# EasyEDA Pro project ProPrj_GD32W515PIQ6_board.epro

# Schematic Schematic1
Board Name: Board1; Create Date: 2026-06-21; Page Name: P1; Project Name: GD32W515PIQ6_board; Schematic Name: Schematic1; Update Date: 2026-06-27; Company: EasyEDA.com; Page Size: A4; Version: V1.0
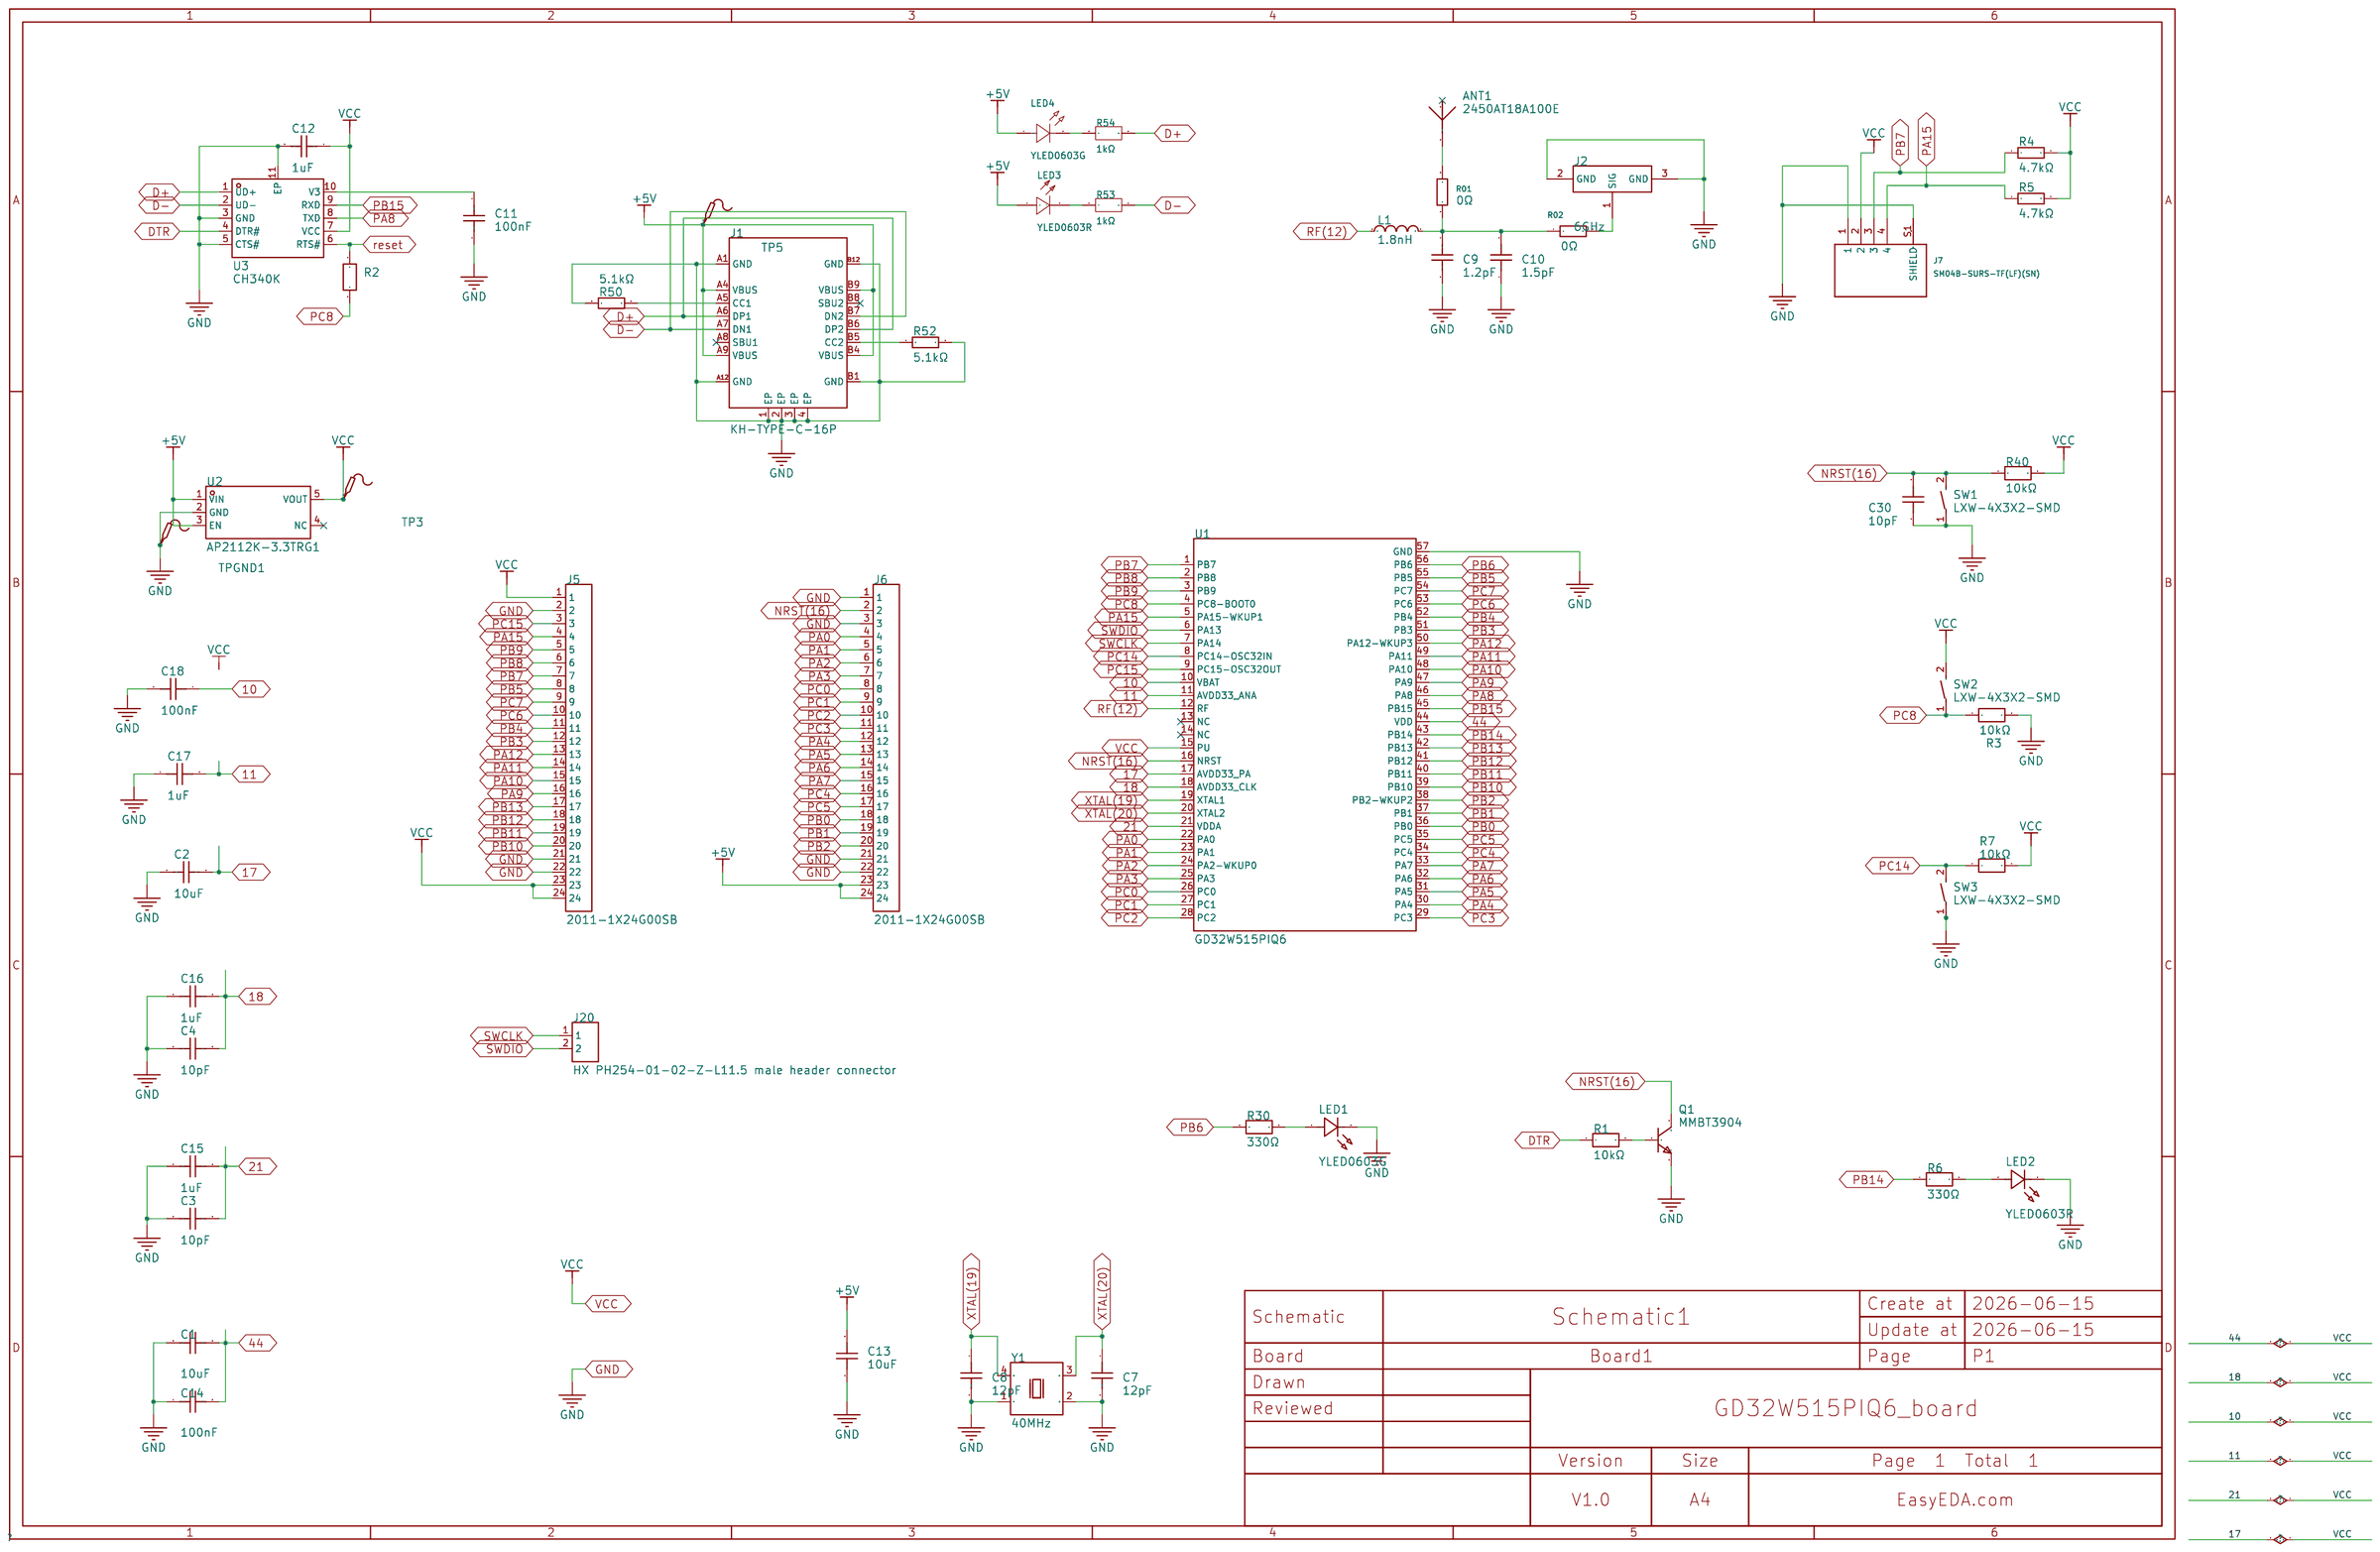
[diagram p0: schematic sheet]

## Parts
ANT1  2450AT18A100E  [ANT-SMD_L3.2-W1.6]
C1  10uF  [C0603]
C2  10uF  [C0603]
C3  10pF  [C0402]
C4  10pF  [C0402]
C7  12pF  [C0402]
C8  12pF  [C0402]
C9  1.2pF  [C0402]
C10  1.5pF  [C0402]
C11  100nF  [C0402]
C12  1uF  [C0603]
C13  10uF  [C0805]
C14  100nF  [C0402]
C15  1uF  [C0402]
C16  1uF  [C0402]
C17  1uF  [C0402]
C18  100nF  [C0402]
C30  10pF  [C0402]
J1  KH-TYPE-C-16P  [USB-C-SMD_KH-TYPE-C-16P]
J2  6GHz  [RF-SMD_FRF05002-JSS103M]
J5  2011-1X24G00SB  [HDR-TH_2011-1X24G00SB]
J6  2011-1X24G00SB  [HDR-TH_2011-1X24G00SB]
J7  SM04B-SURS-TF(LF)(SN)  [CONN-SMD_SM04B-SURS-TF-LF-SN]
J20  HX PH254-01-02-Z-L11.5 male header connector  [HDR-TH_2P-P2.54-V-M]
L1  1.8nH  [IND-SMD_L1.2-W0.6-1]
LED1  YLED0603G  [LED0603-FD]
LED2  YLED0603R  [LED0603-RD-1]
LED3  YLED0603R  [LED0603-FD]
LED4  YLED0603G  [LED0603-FD]
Q1  MMBT3904  [SOT-23-3_L2.9-W1.3-P1.90-LS2.4-BR]
R01  0Ω  [R0402]
R1  10kΩ  [R0402]
R02  0Ω  [R0402]
R2  1kΩ  [R0402]
R3  10kΩ  [R0402]
R4  4.7kΩ  [R0402]
R5  4.7kΩ  [R0402]
R6  330Ω  [R0402]
R7  10kΩ  [R0402]
R30  330Ω  [R0402]
R40  10kΩ  [R0402]
R50  5.1kΩ  [R0402]
R52  5.1kΩ  [R0402]
R53  1kΩ  [R0402]
R54  1kΩ  [R0402]
SW1  LXW-4X3X2-SMD  [SW-SMD_L3.9-W3.0-LS5.0]
SW2  LXW-4X3X2-SMD  [SW-SMD_L3.9-W3.0-LS5.0]
SW3  LXW-4X3X2-SMD  [SW-SMD_L3.9-W3.0-LS5.0]
TP3  -  [Test-Point-0.5mm]
TP5  -  [Test-Point-0.5mm]
TPGND1  -  [Test-Point-0.5mm]
U1  GD32W515PIQ6  [QFN-56_L7.0-W7.0-P0.40-TL-EP5.2]
U2  AP2112K-3.3TRG1  [SOT-25-5_L2.9-W1.6-P0.95-LS2.8-BL]
U3  CH340K  [ESOP-10_L4.9-W3.9-P1.00-LS6.2-BL-EP]
Y1  40MHz  [OSC-SMD_4P-L5.0-W3.2-BL_SG5032]

## Library data of the parts
ANT1 = 2450AT18A100E: Antenna Type:Patch Antenna Frequency(Center/Band):2.4GHz Bandwidth:- Peak Gain:0.5dBi Peak Gain:0.5dBi Impedance:50Ω Power:2W VSWR:- Operating Temperature:-40℃~+125℃ Operating Temperature:-40℃~+125℃ Connector Type:SMA Length:3.2mm Width:1.6mm Height:1.3mm; LCSC Part Name: 2.4G天线; Supplier Part: C89334; Manufacturer: JOHANSON(约翰逊); Supplier Footprint: 1206; JLCPCB Part Class: Extended Part; Datasheet: https://item.szlcsc.com/datasheet/2450AT18A100E/90514.html; Supplier: LCSC; Antenna Type: Patch Antenna; Frequency(Center/Band): 2.4GHz; Peak Gain: 0.5dBi; Impedance: 50Ω; Power: 2W; Operating Temperature: -40℃~+125℃; Connector Type: SMA; Length: 3.2mm; Width: 1.6mm; Height: 1.3mm
C1 = C0603B106M007T: Capacitance:10uF Tolerance:±20% Tolerance:±20% Voltage Rating:6.3V Temperature Coefficient:X5R; LCSC Part Name: 10uF ±20% 6.3V; Supplier Part: C7094065; Manufacturer: IHHEC(禾伸堂); Supplier Footprint: 0603; JLCPCB Part Class: Extended Part; Datasheet: https://item.szlcsc.com/datasheet/C0603B106M007T/8060709.html; Supplier: LCSC; Tolerance: ±20%; Voltage Rating: 6.3V; Temperature Coefficient: X5R
C2 = C0603B106K010T: Capacitance:10uF Tolerance:±10% Tolerance:±10% Voltage Rating:10V Temperature Coefficient:X5R; LCSC Part Name: 10uF ±10% 10V; Supplier Part: C2998546; Manufacturer: IHHEC(禾伸堂); Supplier Footprint: 0603; JLCPCB Part Class: Extended Part; Datasheet: https://item.szlcsc.com/datasheet/C0603B106K010T/3472767.html; Supplier: LCSC; Tolerance: ±10%; Voltage Rating: 10V; Temperature Coefficient: X5R
C3 C4 = C0402C0G1C100E: Capacitance:10pF Tolerance:- Tolerance:- Voltage Rating:16V Temperature Coefficient:NP0；C0G; LCSC Part Name: 10pF 16V; Supplier Part: C19377803; Manufacturer: TDK; JLCPCB Part Class: Extended Part; Datasheet: https://atta.szlcsc.com/upload/public/pdf/source/20140319/1457707021360.pdf; Supplier: LCSC; Voltage Rating: 16V; Temperature Coefficient: NP0；C0G
C7 C8 = CC0402JRNPO7BN120: Capacitance: Tolerance:±5% Tolerance:±5% Voltage Rated: Temperature Coefficient:; LCSC Part Name: 12pF ±5% 16V; Supplier Part: C1852904; Manufacturer: YAGEO(国巨); Supplier Footprint: 0402; JLCPCB Part Class: Extended Part; Datasheet: https://atta.szlcsc.com/upload/public/pdf/source/20210519/C1852904_A04129AA424F7F021D5E78791CAAB2FF.pdf; Supplier: LCSC; Tolerance: ±5%
C9 = C0402C0G1C1R2B: Capacitance:1.2pF Tolerance:- Tolerance:- Voltage Rating:16V Temperature Coefficient:NP0；C0G; LCSC Part Name: 1.2pF 16V; Supplier Part: C19575091; Manufacturer: TDK; JLCPCB Part Class: Extended Part; Datasheet: https://item.szlcsc.com/datasheet/C0402C0G1C1R2B/20862738.html; Supplier: LCSC; Voltage Rating: 16V; Temperature Coefficient: NP0；C0G
C10 = C0402CH1C1R5C020BC: Capacitance:1.5pF Voltage Rating:16V Temperature Coefficient:-; LCSC Part Name: ±0.25pF 1.5pF 16V; Supplier Part: C19416497; Manufacturer: TDK; JLCPCB Part Class: Extended Part; Datasheet: https://atta.szlcsc.com/upload/public/pdf/source/20190114/C363926_7E597D123A0E7E55734060CC1336CCA3.pdf; Supplier: LCSC; Voltage Rating: 16V
C11 = C0402X104K025T: Capacitance:100nF Tolerance:±10% Tolerance:±10% Voltage Rating:25V Temperature Coefficient:X7R; LCSC Part Name: 100nF ±10% 25V; Supplier Part: C559125; Manufacturer: IHHEC(禾伸堂); Supplier Footprint: 0402; JLCPCB Part Class: Extended Part; Datasheet: https://item.szlcsc.com/datasheet/C0402X104K025T/583162.html; Supplier: LCSC; Tolerance: ±10%; Voltage Rating: 25V; Temperature Coefficient: X7R
C12 = C0603X105K025T: Capacitance:1uF Tolerance:±10% Tolerance:±10% Voltage Rating:25V Temperature Coefficient:X7R; LCSC Part Name: 1uF ±10% 25V; Supplier Part: C559292; Manufacturer: IHHEC(禾伸堂); Supplier Footprint: 0603; JLCPCB Part Class: Extended Part; Datasheet: https://item.szlcsc.com/datasheet/C0603X105K025T/583174.html; Supplier: LCSC; Tolerance: ±10%; Voltage Rating: 25V; Temperature Coefficient: X7R
C13 = C2012X5R1H106KT0A0E: LCSC Part Name: 10uF ±10% 50V; Supplier Part: C25503213; Manufacturer: TDK; Supplier Footprint: 0805; Datasheet: https://item.szlcsc.com/datasheet/C2012X5R1H106KT0A0E/27234059.html; Supplier: LCSC; Tolerance: ±10%; Voltage Rating: 50V; Temperature Coefficient: X5R
C14 C18 = GRM155R11C104KA88D: LCSC Part Name: 100nF ±10% 16V; Supplier Part: C464413; Manufacturer: muRata(村田); Supplier Footprint: 0402; JLCPCB Part Class: Extended Part; Datasheet: https://item.szlcsc.com/datasheet/GRM155R11C104KA88D/469343.html; Supplier: LCSC; Tolerance: ±10%; Voltage Rating: 16V
C15-C17 = C0402X6S105K6R3NT: LCSC Part Name: 1uF ±10% 6.3V; Supplier Part: C2844323; Manufacturer: SANYEAR(叁叶源); Supplier Footprint: 0402; JLCPCB Part Class: Extended Part; Datasheet: https://item.szlcsc.com/datasheet/C0402X6S105K6R3NT/3035175.html; Supplier: LCSC; Tolerance: ±10%; Voltage Rating: 6.3V
C30 = CC0402DRNPO8BN100: Capacitance:10pF Voltage Rating:25V Temperature Coefficient:NP0; LCSC Part Name: ±0.5pF 10pF 25V; Supplier Part: C526976; Manufacturer: YAGEO(国巨); Supplier Footprint: 0402; JLCPCB Part Class: Extended Part; Datasheet: https://item.szlcsc.com/datasheet/CC0402DRNPO8BN100/545402.html; Supplier: LCSC; Voltage Rating: 25V; Temperature Coefficient: NP0
J1 = KH-TYPE-C-16P: LCSC Part Name: Type-C 母 卧贴; Supplier Part: C709357; Manufacturer: kinghelm(金航标); Supplier Footprint: SMD; JLCPCB Part Class: Extended Part; Datasheet: https://item.szlcsc.com/datasheet/KH-TYPE-C-16P/747093.html; Supplier: LCSC; Connector Type: Type-C; Gender: Female; Mounting Type: Surface Mount, Right Angle; Number of Contacts: 16P; Number of Ports: 1; Current Rating-Power: 3A; Voltage Rating: 30V; Connect-Disconnect Life: 10,000 cycles; Length: 7.81mm; Operating Temperature: -40℃~+85℃
J2 = CONUFL001-SMD-T: Connector Type:Board Side Interface:Male Pin Number of Ports:1 Frequency:6GHz Impedance:50Ω Operating Temperature Range:-40℃~+90℃ Operating Temperature Range:-40℃~+90℃; LCSC Part Name: 内针; Supplier Part: C22418213; Manufacturer: TE Connectivity(泰科电子); Supplier Footprint: SMD; JLCPCB Part Class: Extended Part; Datasheet: https://item.szlcsc.com/datasheet/CONUFL001-SMD-T/24041852.html; Supplier: LCSC; Connector Type: Board Side; Interface: Male Pin; Number of Ports: 1; Impedance: 50Ω; Operating Temperature Range: -40℃~+90℃
J5 = 2011-1X24G00SB: LCSC Part Name: 1x24P 间距:2.54mm 方针 直插; Supplier Part: C49569647; Manufacturer: WingTAT(格林柏); Supplier Footprint: 插件,P=2.54mm; JLCPCB Part Class: Extended Part; Datasheet: https://item.szlcsc.com/datasheet/2011-1X24G00SB/52123955.html; Supplier: LCSC; Pin Structure: 1x24P; Pitch: 2.54mm; Circluar Pins/Square Pins: Pin Header; Mounting Type: Through Hole; Number of Rows: 1; Number of Pins: 24P; Current Rating: 3A; Voltage Rating (Max): 600V; Length of Mating Pin: 6mm; Insulation Height: 2.5mm; Length of End Connection Pin: 3mm; Contact Material: Brass; Contact Plating: Gold; Operating Temperature: -40℃~+105℃; Color: Black
J6 = 2011-1X24G00SB: Pin Structure:1x24P Pitch:2.54mm Circluar Pins/Square Pins:Pin Header Mounting Type:Through Hole Number of Rows:1 Number of Pins:24P Current Rating:3A Voltage Rating (Max):600V Length of Mating Pin:6mm Insulation Height:2.5mm Length of End Connection Pin:; LCSC Part Name: 1x24P 间距:2.54mm 方针 直插; Supplier Part: C49569647; Manufacturer: WingTAT(格林柏); Supplier Footprint: 插件,P=2.54mm; JLCPCB Part Class: Extended Part; Datasheet: https://item.szlcsc.com/datasheet/2011-1X24G00SB/52123955.html; Supplier: LCSC; Pin Structure: 1x24P; Pitch: 2.54mm; Circluar Pins/Square Pins: Pin Header; Mounting Type: Through Hole; Number of Rows: 1; Number of Pins: 24P; Current Rating: 3A; Voltage Rating (Max): 600V; Length of Mating Pin: 6mm; Insulation Height: 2.5mm; Length of End Connection Pin: 3mm; Contact Material: Brass; Contact Plating: Gold; Operating Temperature: -40℃~+105℃; Color: Black
J7 = SM04B-SURS-TF(LF)(SN): Pins Structure:1x4P Pitch:0.8mm Mounting Type:Surface Mount, Right Angle Reference Series:SUR Number of Pins:4P Number of Rows:1 Number of PINs Per Row:4 Row Spacing:- Current Rating:500mA Contact Material:Copper Alloy Contact Plating:Tin Operating Temper; LCSC Part Name: 1x4P 间距:0.8mm 卧贴 系列:SUR; Supplier Part: C545754; Manufacturer: JST; Supplier Footprint: SMD,P=0.8mm,卧贴; JLCPCB Part Class: Extended Part; Datasheet: https://item.szlcsc.com/datasheet/SM04B-SURS-TF(LF)(SN)/566855.html; Supplier: LCSC; Pins Structure: 1x4P; Pitch: 0.8mm; Mounting Type: Surface Mount, Right Angle; Reference Series: SUR; Number of Pins: 4P; Number of Rows: 1; Number of PINs Per Row: 4; Current Rating: 500mA; Contact Material: Copper Alloy; Contact Plating: Tin; Operating Temperature: -25℃~+85℃; Voltage Rating: 30V; Plastic Material: PA; Flame Retardant Rating: UL94V-0; Supplementary Features: Auxiliary Solder Pin; Color: White; Z-Height of the Board: 1.75mm; X-Length of Bottom Edge on Board (Spacing Line): 5.4mm; Y-Width of Bottom Edge on Board: 2.7mm
J20 = HX PH254-01-02-Z-L11.5 male header connector: LCSC Part Name: 1x2P 间距:2.54mm 方针 直插; Supplier Part: C52016390; Manufacturer: hanxia(韩下); Supplier Footprint: 插件,P=2.54mm; JLCPCB Part Class: Extended Part; Datasheet: https://item.szlcsc.com/datasheet/HX%2520PH254-01-02-Z-L11.5%2520male%2520header%2520connector/54760435.html; Supplier: LCSC; Pin Structure: 1x2P; Pitch: 2.54mm; Circluar Pins/Square Pins: Pin Header; Mounting Type: Through Hole; Number of Rows: 1; Number of Pins: 2P; Current Rating: 3A; Voltage Rating (Max): 1kV; Length of Mating Pin: 6mm; Insulation Height: 2.5mm; Length of End Connection Pin: 3mm; Contact Material: Brass; Contact Plating: Gold; Operating Temperature: -40℃~+105℃
L1 = SCW1005C1N8JST: Inductance:1.8nH Tolerance:±5% Tolerance:±5% Current Rating:950mA Current - Saturation (Isat):- DC Resistance(DCR):43mΩ Q @ Frequency:- Frequency - Self Resonant:- Ratings:-; LCSC Part Name: 1.8nH ±5%; Supplier Part: C330833; Manufacturer: Sunltech(顺磁); Supplier Footprint: 0402; JLCPCB Part Class: Extended Part; Datasheet: https://item.szlcsc.com/datasheet/SCW1005C1N8JST/310235.html; Supplier: LCSC; Tolerance: ±5%; Current Rating: 950mA; DC Resistance(DCR): 43mΩ
LED1 LED4 = YLED0603G: Lamp Holder Type:- Illumination Color:Emerald Green Voltage - Forward(Vf):2.6V~3.2V Voltage - Forward(Vf):2.6V~3.2V Power(Watts):- Forward Current:25mA Wavelength - Dominant:510nm~531nm Wavelength - Dominant:510nm~531nm Peak Wavelength:- Peak Wavelength:-; LCSC Part Name: 翠绿色 独立二极管; Supplier Part: C19273151; Manufacturer: YONGYUTAI(永裕泰); Supplier Footprint: 0603; JLCPCB Part Class: Extended Part; Datasheet: https://item.szlcsc.com/datasheet/YLED0603G/20555405.html; Supplier: LCSC; Illumination Color: Emerald Green; Voltage - Forward(Vf): 2.6V~3.2V; Forward Current: 25mA; Wavelength - Dominant: 510nm~531nm; Diode Configuration: Discrete Diode; Luminous Intensity: 358mcd; Viewing Angle: 120°; Operating Temperature: -40℃~+85℃
LED2 LED3 = YLED0603R: Lamp Holder Type:-；- Illumination Color:Red Voltage - Forward(Vf):1.8V~2.4V Voltage - Forward(Vf):1.8V~2.4V Power(Watts):- Forward Current:25mA Wavelength - Dominant:620nm~625nm Wavelength - Dominant:620nm~625nm Peak Wavelength:- Diode Configuration:Discr; LCSC Part Name: 红色 独立二极管; Supplier Part: C19171390; Manufacturer: YONGYUTAI(永裕泰); Supplier Footprint: 0603; JLCPCB Part Class: Extended Part; Datasheet: https://item.szlcsc.com/datasheet/YLED0603R/20382441.html; Supplier: LCSC; Lamp Holder Type: -；-; Illumination Color: Red; Voltage - Forward(Vf): 1.8V~2.4V; Forward Current: 25mA; Wavelength - Dominant: 620nm~625nm; Diode Configuration: Discrete Diode; Luminous Intensity: 120mcd; Viewing Angle: 120°; Operating Temperature: -40℃~+85℃
Q1 = MMBT3904_C51953474: type:NPN Current - Collector(Ic):200mA Collector - Emitter Voltage VCEO:40V Pd - Power Dissipation:200mW DC Current Gain:300@10mA,1V DC Current Gain:300@10mA,1V Transition frequency(fT):300MHz Current - Collector Cutoff:100nA Vce Saturation(VCE(sat)):300m; LCSC Part Name: MMBT3904 hFE:100-300 NPN 晶体管 电流：200mA 电压：40V; Supplier Part: C51953474; Manufacturer: CCX(晁禾); Supplier Footprint: SOT-23; JLCPCB Part Class: Extended Part; Datasheet: https://item.szlcsc.com/datasheet/MMBT3904/54682184.html; Supplier: LCSC; type: NPN; Current - Collector(Ic): 200mA; Collector - Emitter Voltage VCEO: 40V; Pd - Power Dissipation: 200mW; DC Current Gain: 300@10mA,1V; Transition frequency(fT): 300MHz; Current - Collector Cutoff: 100nA; Vce Saturation(VCE(sat)): 300mV@50mA,5mA; Operating Temperature: -55℃~+150℃; Emitter-Base Voltage(Vebo): 6V; Number: 1 NPN Transistor
R01 R02 = JR0402X20E: Type:- Resistance:0Ω Tolerance:- Tolerance:- Power(Watts):200mW Voltage-Supply(Max):- Temperature Coefficient:- Temperature Coefficient:- Operating Temperature:-55℃~+150℃ Operating Temperature:-55℃~+150℃; LCSC Part Name: 0Ω 200mW; Supplier Part: C2482372; Manufacturer: Ohmite; Supplier Footprint: 0402; JLCPCB Part Class: Extended Part; Datasheet: https://item.szlcsc.com/datasheet/JR0402X20E/2574238.html; Supplier: LCSC; Power(Watts): 200mW; Operating Temperature: -55℃~+150℃
R1 R3 R40 = CR0402JF0103G: Type:Thick Film Resistors Resistance: Tolerance:±5% Tolerance:±5% Power(Watts): Overload Voltage (Max): Temperature Coefficient:±200ppm/℃ Temperature Coefficient:±200ppm/℃ Operating Temperature Range:-55℃~+125℃ Operating Temperature Range:-55℃~+125℃; LCSC Part Name: 厚膜电阻 10kΩ ±5% 62.5mW; Supplier Part: C100572; Manufacturer: LIZ(丽智电子); Supplier Footprint: 0402; JLCPCB Part Class: Extended Part; Datasheet: https://atta.szlcsc.com/upload/public/pdf/source/20180403/C189438_6D658388CC7843F35BBC9018D03F0B8E.pdf; Supplier: LCSC; Type: Thick Film Resistors; Tolerance: ±5%; Temperature Coefficient: ±200ppm/℃; Operating Temperature Range: -55℃~+125℃
R2 = CR0402FF1001G: Type:Thick Film Resistor Resistance:1kΩ Tolerance:±1% Tolerance:±1% Power(Watts):62.5mW Voltage-Supply(Max):50V Temperature Coefficient:±200ppm/℃ Temperature Coefficient:±200ppm/℃ Operating Temperature:-55℃~+125℃ Operating Temperature:-55℃~+125℃; LCSC Part Name: 厚膜电阻 1kΩ ±1% 62.5mW; Supplier Part: C100195; Manufacturer: LIZ(丽智电子); Supplier Footprint: 0402; JLCPCB Part Class: Extended Part; Datasheet: https://item.szlcsc.com/datasheet/CR0402FF1001G/101410.html; Supplier: LCSC; Type: Thick Film Resistor; Tolerance: ±1%; Power(Watts): 62.5mW; Voltage-Supply(Max): 50V; Temperature Coefficient: ±200ppm/℃; Operating Temperature: -55℃~+125℃
R4 R5 = CR0402JF0472G: Type:Thick Film Resistor Resistance:4.7kΩ Tolerance:±5% Tolerance:±5% Power(Watts):62.5mW Voltage-Supply(Max):50V Temperature Coefficient:±200ppm/℃ Temperature Coefficient:±200ppm/℃ Operating Temperature:-55℃~+125℃ Operating Temperature:-55℃~+125℃; LCSC Part Name: 厚膜电阻 4.7kΩ ±5% 62.5mW; Supplier Part: C100658; Manufacturer: LIZ(丽智电子); Supplier Footprint: 0402; JLCPCB Part Class: Extended Part; Datasheet: https://item.szlcsc.com/datasheet/CR0402JF0472G/101873.html; Supplier: LCSC; Type: Thick Film Resistor; Tolerance: ±5%; Power(Watts): 62.5mW; Voltage-Supply(Max): 50V; Temperature Coefficient: ±200ppm/℃; Operating Temperature: -55℃~+125℃
R6 = CR0402J330RQ10Z: LCSC Part Name: 厚膜电阻 330Ω ±5% 63mW; Supplier Part: C881128; Manufacturer: EVER OHMS(天二科技); Supplier Footprint: 0402; JLCPCB Part Class: Extended Part; Datasheet: https://item.szlcsc.com/datasheet/CR0402J330RQ10Z/944043.html; Supplier: LCSC; Type: Thick Film Resistor; Tolerance: ±5%; Power(Watts): 63mW; Voltage-Supply(Max): 50V; Temperature Coefficient: ±100ppm/℃; Operating Temperature: -55℃~+155℃
R7 = SCR0402J10K: LCSC Part Name: 厚膜电阻 10kΩ ±5% 62.5mW; Supplier Part: C3017497; Manufacturer: VO(翔胜); Supplier Footprint: 0402; JLCPCB Part Class: Extended Part; Datasheet: https://item.szlcsc.com/datasheet/SCR0402J10K/3530021.html; Supplier: LCSC; Type: Thick Film Resistor; Tolerance: ±5%; Power(Watts): 62.5mW; Voltage-Supply(Max): 50V; Operating Temperature: -55℃~+155℃
R30 = CR0402JF0331G: Type:Thick Film Resistor Resistance:330Ω Tolerance:±5% Tolerance:±5% Power(Watts):62.5mW Voltage-Supply(Max):50V Temperature Coefficient:±200ppm/℃ Temperature Coefficient:±200ppm/℃ Operating Temperature:-55℃~+125℃ Operating Temperature:-55℃~+125℃; LCSC Part Name: 厚膜电阻 330Ω ±5% 62.5mW; Supplier Part: C100639; Manufacturer: LIZ(丽智电子); Supplier Footprint: 0402; JLCPCB Part Class: Extended Part; Datasheet: https://item.szlcsc.com/datasheet/CR0402JF0331G/101854.html; Supplier: LCSC; Type: Thick Film Resistor; Tolerance: ±5%; Power(Watts): 62.5mW; Voltage-Supply(Max): 50V; Temperature Coefficient: ±200ppm/℃; Operating Temperature: -55℃~+125℃
R50 R52 = HPCR0402F5K10K9: Type:Thick Film Resistors Resistance:5.1kΩ Tolerance:±1% Tolerance:±1% Power(Watts):100mW Voltage-Supply(Max):50V Temperature Coefficient:±100ppm/℃ Temperature Coefficient:±100ppm/℃ Operating Temperature:-55℃~+125℃ Operating Temperature:-55℃~+125℃; LCSC Part Name: 厚膜电阻 5.1kΩ ±1% 100mW; Supplier Part: C365032; Manufacturer: RESI(开步睿思); Supplier Footprint: 0402; JLCPCB Part Class: Extended Part; Datasheet: https://item.szlcsc.com/datasheet/HPCR0402F5K10K9/339248.html; Supplier: LCSC; Type: Thick Film Resistors; Tolerance: ±1%; Power(Watts): 100mW; Voltage-Supply(Max): 50V; Temperature Coefficient: ±100ppm/℃; Operating Temperature: -55℃~+125℃
R53 R54 = RT0402BRD071KL: Type:Thin Film Resistor Resistance:1kΩ Tolerance:±0.1% Tolerance:±0.1% Power(Watts):62.5mW Voltage-Supply(Max):50V Temperature Coefficient:±25ppm/℃ Temperature Coefficient:±25ppm/℃ Operating Temperature:-55℃~+155℃ Operating Temperature:-55℃~+155℃; LCSC Part Name: 薄膜电阻 1kΩ ±0.1% 62.5mW; Supplier Part: C852624; Manufacturer: YAGEO(国巨); Supplier Footprint: 0402; JLCPCB Part Class: Extended Part; Datasheet: https://item.szlcsc.com/datasheet/RT0402BRD071KL/912946.html; Supplier: LCSC; Type: Thin Film Resistor; Tolerance: ±0.1%; Power(Watts): 62.5mW; Voltage-Supply(Max): 50V; Temperature Coefficient: ±25ppm/℃; Operating Temperature: -55℃~+155℃
SW1-SW3 = LXW-4X3X2-SMD: LCSC Part Name: 4*3*2mm 立贴 轻触开关; Supplier Part: C53447012; Manufacturer: LXWCONN(连兴旺电子); Supplier Footprint: SMD; JLCPCB Part Class: Extended Part; Datasheet: https://item.szlcsc.com/datasheet/LXW-4X3X2-SMD/56599271.html; Supplier: LCSC
TP3 TP5 TPGND1 = Test-Point: Test Point 测试点
U1 = GD32W515PIQ6: CPU Core:ARM Cortex-M Series CPU Maximum Speed:180MHz Program Storage Size:2MB Program Memory Type:FLASH Number of I/O:43 ADC (Bit):12bit; LCSC Part Name: Arm Cortex-M33 32位微控制器（MCU）; Supplier Part: C3202814; Manufacturer: GigaDevice(兆易创新); Supplier Footprint: QFN-56-EP(7x7); JLCPCB Part Class: Extended Part; Datasheet: https://item.szlcsc.com/datasheet/GD32W515PIQ6/3764781.html; Supplier: LCSC; CPU Core: ARM Cortex-M Series; CPU Maximum Speed: 180MHz; Program Storage Size: 2MB; Program Memory Type: FLASH; Number of I/O: 43; ADC (Bit): 12bit
U2 = AP2112K-3.3TRG1_C23380830: Output Configuration:Positive Voltage - Supply:5.5V Output Voltage:3.3V Output Voltage:3.3V Output Current:600mA Power Supply Rejection Ratio (PSRR):75dB@(1kHz) Voltage Dropout:320mV@(600mA) standby current:10uA Noise:- Features:Enable control；Over Curren; LCSC Part Name: 3.3V 600mA 5.5V; Supplier Part: C23380830; Manufacturer: TECH PUBLIC(台舟); Supplier Footprint: SOT-23-5; JLCPCB Part Class: Extended Part; Datasheet: https://item.szlcsc.com/datasheet/AP2112K-3.3TRG1/25111500.html; Supplier: LCSC; Output Configuration: Positive; Voltage - Supply: 5.5V; Output Voltage: 3.3V; Output Current: 600mA; Power Supply Rejection Ratio (PSRR): 75dB@(1kHz); Voltage Dropout: 320mV@(600mA); standby current: 10uA; Features: Enable control；Over Current Protection；Output discharge；Thermal shutdown; Operating Temperature: -40℃~+85℃@(Ta); Output Type: Fixed; Number of Outputs: 1
U3 = CH340K: Applications Function:USB to serial Protocol:USB 2.0 Number of Channels:- Voltage - Supply:3.3V；5V Voltage - Supply:3.3V；5V Data Rate:2Mbps Operating Temperature:-20℃~+70℃ Operating Temperature:-20℃~+70℃; LCSC Part Name: USB转串口芯片CH340; Supplier Part: C968586; Manufacturer: WCH(南京沁恒); Supplier Footprint: ESSOP-10-150mil-1mm; JLCPCB Part Class: Extended Part; Datasheet: https://item.szlcsc.com/datasheet/CH340K/1056391.html; Supplier: LCSC; Applications Function: USB to serial; Protocol: USB 2.0; Voltage - Supply: 3.3V；5V; Data Rate: 2Mbps; Operating Temperature: -20℃~+70℃
Y1 = OVETGLJANF-40MHZ: Frequency:40MHz Voltage - Supply:3.3V Voltage - Supply:3.3V Current - Supply:20mA Frequency Stability:±50ppm Frequency Stability:±50ppm Operating Temperature:-40℃~+85℃ Operating Temperature:-40℃~+85℃; LCSC Part Name: 40MHz 3.3V; Supplier Part: C295515; Manufacturer: TAITIEN(泰艺电子); Supplier Footprint: SMD5032-4P; JLCPCB Part Class: Extended Part; Datasheet: https://item.szlcsc.com/datasheet/OVETGLJANF-40MHZ/279944.html; Supplier: LCSC; Voltage - Supply: 3.3V; Current - Supply: 20mA; Frequency Stability: ±50ppm; Operating Temperature: -40℃~+85℃

## Nets
+5V: C13.2 J1.A4(VBUS) J1.A9(VBUS) J1.B4(VBUS) J1.B9(VBUS) J6.23 J6.24 LED3.1(+) LED4.1(+) TP5.1 U2.1(VIN) U2.3(EN)
GND: C1.2 C2.1 C3.1 C4.1 C7.2 C8.2 C9.2 C10.1 C11.2 C12.2 C13.1 C14.1 C15.1 C16.1 C17.1 C18.2 C30.1 J1.1(EP) J1.2(EP) J1.3(EP) J1.4(EP) J1.A1(GND) J1.A12(GND) J1.B1(GND) J1.B12(GND) J2.2(GND) J2.3(GND) J5.2 J5.21 J5.22 J6.1 J6.3 J6.21 J6.22 J7.1 J7.S1(SHIELD) J7.S2(SHIELD) LED1.2(K) LED2.1(C) Q1.2(E) R3.2 R50.1 R52.2 SW1.1 SW3.1 TPGND1.1 U1.57(GND) U2.2(GND) U3.3(GND) U3.5(CTS#) U3.11(EP) Y1.1(tri) Y1.2(GND)
VCC: C1.1 C2.2 C3.2 C4.2 C12.1 C14.2 C15.2 C16.2 C17.2 C18.1 J5.1 J5.23 J5.24 J7.2 R4.2 R5.2 R7.2 R40.2 SW2.2 TP3.1 U1.10(VBAT) U1.11(AVDD33_ANA) U1.15(PU) U1.17(AVDD33_PA) U1.18(AVDD33_CLK) U1.21(VDDA) U1.44(VDD) U2.5(VOUT) U3.7(VCC)
D+: J1.A6(DP1) J1.B6(DP2) R54.2 U3.1(UD+)
D-: J1.A7(DN1) J1.B7(DN2) R53.2 U3.2(UD-)
DTR: R1.1 U3.4(DTR#)
NRST(16): C30.2 J6.2 Q1.3(C) R40.1 SW1.2 U1.16(NRST)
PA0: J6.4 U1.22(PA0)
PA1: J6.5 U1.23(PA1)
PA2: J6.6 U1.24(PA2-WKUP0)
PA3: J6.7 U1.25(PA3)
PA4: J6.12 U1.30(PA4)
PA5: J6.13 U1.31(PA5)
PA6: J6.14 U1.32(PA6)
PA7: J6.15 U1.33(PA7)
PA8: U1.46(PA8) U3.8(TXD)
PA9: J5.16 U1.47(PA9)
PA10: J5.15 U1.48(PA10)
PA11: J5.14 U1.49(PA11)
PA12: J5.13 U1.50(PA12-WKUP3)
PA15: J5.4 J7.4 R5.1 U1.5(PA15-WKUP1)
PB0: J6.18 U1.36(PB0)
PB1: J6.19 U1.37(PB1)
PB2: J6.20 U1.38(PB2-WKUP2)
PB3: J5.12 U1.51(PB3)
PB4: J5.11 U1.52(PB4)
PB5: J5.8 U1.55(PB5)
PB6: R30.1 U1.56(PB6)
PB7: J5.7 J7.3 R4.1 U1.1(PB7)
PB8: J5.6 U1.2(PB8)
PB9: J5.5 U1.3(PB9)
PB10: J5.20 U1.39(PB10)
PB11: J5.19 U1.40(PB11)
PB12: J5.18 U1.41(PB12)
PB13: J5.17 U1.42(PB13)
PB14: R6.1 U1.43(PB14)
PB15: U1.45(PB15) U3.9(RXD)
PC0: J6.8 U1.26(PC0)
PC1: J6.9 U1.27(PC1)
PC2: J6.10 U1.28(PC2)
PC3: J6.11 U1.29(PC3)
PC4: J6.16 U1.34(PC4)
PC5: J6.17 U1.35(PC5)
PC6: J5.10 U1.53(PC6)
PC7: J5.9 U1.54(PC7)
PC8: R2.2 R3.1 SW2.1 U1.4(PC8-BOOT0)
PC14: R7.1 SW3.2 U1.8(PC14-OSC32IN)
PC15: J5.3 U1.9(PC15-OSC32OUT)
reset: R2.1 U3.6(RTS#)
RF(12): L1.1 U1.12(RF)
SWCLK: J20.1 U1.7(PA14)
SWDIO: J20.2 U1.6(PA13)
XTAL(19): C8.1 U1.19(XTAL1) Y1.4(VCC)
XTAL(20): C7.1 U1.20(XTAL2) Y1.3(OUT)
$1N59: C11.1 U3.10(V3)
$1N91: C9.1 C10.2 L1.2 R01.1 R02.1
$1N92: ANT1.1(ANT) R01.2
$1N93: J2.1(SIG) R02.2
$1N149: Q1.1(B) R1.2
$1N324: J1.B5(CC2) R52.1
$1N325: J1.A5(CC1) R50.2
$1N10672: LED3.2(-) R53.1
$1N10677: LED4.2(-) R54.1
$1N12939: LED1.1(A) R30.2
$1N12956: LED2.2(A) R6.2

Not connected (* = marked no-connect by the designer): ANT1 2*; J1 A8(SBU1)* B8(SBU2)*; U1 13(NC)* 14(NC)*; U2 4(NC)*

# Board PCB2
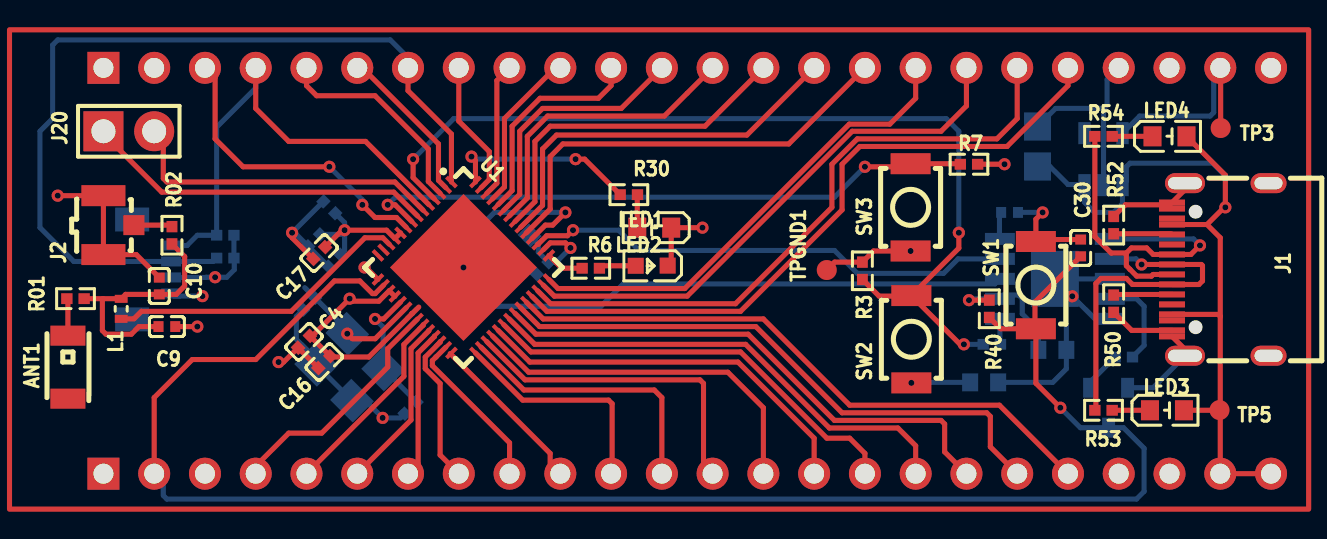
[diagram p1: board, top side]
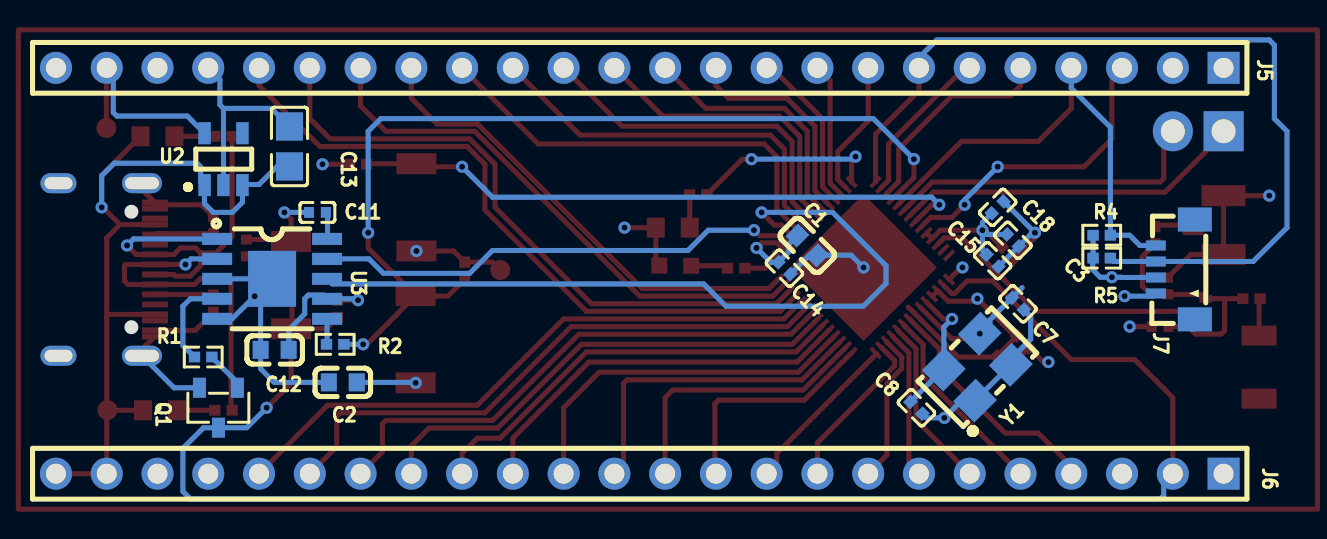
[diagram p2: board, bottom side, seen from below]

Outline 0.69 x 6.47 mm; copper layers: Top Layer, GND, 3.3V, Bottom Layer. Coordinates in mm from the lower left corner of the outline.
Stack: Top Layer 0.035mm Outer layer thickness 1oz / Dielectric1 0.2104mm 7628 RC49% 8.6mil / GND 0.0152mm Inner layer thickness / Dielectric2 1.065mm 1.1mm H/HOZ Copper / 3.3V 0.0152mm Inner layer thickness / Dielectric3 0.2104mm 7628 RC49% 8.6mil / Bottom Layer 0.035mm Outer layer thickness 1oz

## Design rules (mm)
template: JLCPCB Capability(Two Layers Board)
spacing copperThickness1oz (default): track to track 0.102, other pairs 0.152 to 0.3
spacing copperThickness2oz: track to track 0.203, other pairs 0.152 to 0.3
track width copperThickness1oz (default): min 0.127, default 0.254, max 2.54
track width copperThickness2oz: min 0.203, default 0.254, max 2.54
differential pair differentialPair (default): width min 0.127, default 0.254, max 2.54; gap min 0.152, default 0.152
via viaSize (default): diameter min 0.5, default 0.61, max 10; hole min 0.3, default 0.305, max 6.3

## Placement (name value [footprint] x y rotation side)
ANT1  2450AT18A100E  [ANT-SMD_L3.2-W1.6]  -56.08 -1.65 270 top
C1  10uF  [C0603]  -33.47 4.44 225 bottom
C2  10uF  [C0603]  -10.23 -2.42 180 bottom
C3  10pF  [C0402]  -43.76 4.7 45 bottom
C4  10pF  [C0402]  -44.26 -0.38 45 top
C7  12pF  [C0402]  -44.01 1.52 225 bottom
C8  12pF  [C0402]  -38.93 -3.69 225 bottom
C9  1.2pF  [C0402]  -51.12 0.38 0 top
C10  1.5pF  [C0402]  -51.5 2.41 270 top
C11  100nF  [C0402]  -8.96 6.09 0 bottom
C12  1uF  [C0603]  -6.82 -0.79 0 bottom
C13  10uF  [C0805]  -7.56 9.4 270 bottom
C14  100nF  [C0402]  -32.33 3.3 45 bottom
C15  1uF  [C0402]  -42.74 3.68 45 bottom
C16  1uF  [C0402]  -43.25 -1.4 45 top
C17  1uF  [C0402]  -43.5 4.06 45 top
C18  100nF  [C0402]  -42.99 6.35 135 bottom
C30  10pF  [C0402]  -5.4 4.32 270 top
J1  KH-TYPE-C-16P  [USB-C-SMD_KH-TYPE-C-16P]  1.58 3.24 90 top
J2  6GHz  [RF-SMD_FRF05002-JSS103M]  -53.54 5.46 90 top
J5  2011-1X24G00SB  [HDR-TH_2011-1X24G00SB]  -25.09 13.33 0 bottom
J6  2011-1X24G00SB  [HDR-TH_2011-1X24G00SB]  -25.09 -6.99 0 bottom
J7  SM04B-SURS-TF(LF)(SN)  [CONN-SMD_SM04B-SURS-TF-LF-SN]  -51.88 3.24 90 bottom
J20  HX PH254-01-02-Z-L11.5 male header connector  [HDR-TH_2P-P2.54-V-M]  -53.03 10.16 0 top
L1  1.8nH  [IND-SMD_L1.2-W0.6-1]  -53.41 1.27 90 top
LED1  YLED0603G  [LED0603-FD]  -26.74 5.33 0 top
LED2  YLED0603R  [LED0603-RD-1]  -26.87 3.43 180 top
LED3  YLED0603R  [LED0603-FD]  -1.08 -3.81 180 top
LED4  YLED0603G  [LED0603-FD]  -0.96 9.9 180 top
Q1  MMBT3904  [SOT-23-3_L2.9-W1.3-P1.90-LS2.4-BR]  -4.01 -3.69 90 bottom
R01  0Ω  [R0402]  -55.69 1.78 180 top
R1  10kΩ  [R0402]  -3.24 -1.15 180 bottom
R02  0Ω  [R0402]  -50.87 4.95 90 top
R2  1kΩ  [R0402]  -9.85 -0.51 180 bottom
R3  10kΩ  [R0402]  -16.32 3.17 90 top
R4  4.7kΩ  [R0402]  -48.2 3.81 0 bottom
R5  4.7kΩ  [R0402]  -48.2 4.95 0 bottom
R6  330Ω  [R0402]  -29.91 3.3 0 top
R7  10kΩ  [R0402]  -10.99 8.51 0 top
R30  330Ω  [R0402]  -28.01 6.98 0 top
R40  10kΩ  [R0402]  -9.97 1.27 90 top
R50  5.1kΩ  [R0402]  -3.75 1.52 90 top
R52  5.1kΩ  [R0402]  -3.75 5.46 90 top
R53  1kΩ  [R0402]  -4.26 -3.81 180 top
R54  1kΩ  [R0402]  -4.26 9.9 180 top
SW1  LXW-4X3X2-SMD  [SW-SMD_L3.9-W3.0-LS5.0]  -7.64 2.45 270 top
SW2  LXW-4X3X2-SMD  [SW-SMD_L3.9-W3.0-LS5.0]  -13.87 -0.26 270 top
SW3  LXW-4X3X2-SMD  [SW-SMD_L3.9-W3.0-LS5.0]  -13.91 6.35 90 top
TP3  -  [Test-Point-0.5mm]  1.6 10.32 0 top
TP5  -  [Test-Point-0.5mm]  1.54 -3.8 0 top
TPGND1  -  [Test-Point-0.5mm]  -18.11 3.21 0 top
U1  GD32W515PIQ6  [QFN-56_L7.0-W7.0-P0.40-TL-EP5.2]  -36.28 3.34 315 top
U2  AP2112K-3.3TRG1  [SOT-25-5_L2.9-W1.6-P0.95-LS2.8-BL]  -4.26 8.76 180 bottom
U3  CH340K  [ESOP-10_L4.9-W3.9-P1.00-LS6.2-BL-EP]  -6.69 2.77 270 bottom
Y1  40MHz  [OSC-SMD_4P-L5.0-W3.2-BL_SG5032]  -41.98 -1.65 135 bottom

## Footprints (pads in the part's own frame, mm; a bottom-side part is the same pattern mirrored in y, then rotated)
ANT-SMD_L3.2-W1.6
  rect 1x1.75 smd: 1(-1.578,0) 2(1.578,0)
C0402
  rect 0.5x0.54 smd: 1(-0.42,0) 2(0.42,0)
C0603
  rect 0.8x0.9 smd: 1(-0.7,0) 2(0.7,0)
C0805
  rect 1.41x1.35 smd: 1(-1,0) 2(1,0)
CONN-SMD_SM04B-SURS-TF-LF-SN
  rect 0.5x1 smd: 1(-1.2,0.975) 2(-0.4,0.975) 3(0.4,0.975) 4(1.2,0.975)
  rect 1.2x1.7 smd: 5(2.5,-0.975) 6(-2.5,-0.975)
ESOP-10_L4.9-W3.9-P1.00-LS6.2-BL-EP
  rect 0.6x1.5 smd: 1(-2,-2.75) 2(-1,-2.75) 3(0,-2.75) 4(1,-2.75) 5(2,-2.75) 6(2,2.75) 7(1,2.75) 8(0,2.75) 9(-1,2.75) 10(-2,2.75)
  rect 2.8x2.4 smd: 11(0,0)
HDR-TH_2P-P2.54-V-M
  rect 2x2 hole 1.2: 1(-1.27,0)
  round 2 hole 1.2: 2(1.27,0)
HDR-TH_2011-1X24G00SB
  rect 1.6x1.6 hole 1: 1(-29.21,0)
  round 1.6 hole 1: 2(-26.67,0) 3(-24.13,0) 4(-21.59,0) 5(-19.05,0) 6(-16.51,0) 7(-13.97,0) 8(-11.43,0) 9(-8.89,0) 10(-6.35,0) 11(-3.81,0) 12(-1.27,0) 13(1.27,0) 14(3.81,0) 15(6.35,0) 16(8.89,0) 17(11.43,0) 18(13.97,0) 19(16.51,0) 20(19.05,0) 21(21.59,0) 22(24.13,0) 23(26.67,0) 24(29.21,0)
IND-SMD_L1.2-W0.6-1
  rect 0.4x0.64 smd: 1(-0.5,0) 2(0.5,0)
LED0603-FD
  rect 0.9x1 smd: 1(-0.85,0) 2(0.85,0)
LED0603-RD-1
  rect 0.8x0.8 smd: 1(-0.799,-0.004) 2(0.799,0.004)
OSC-SMD_4P-L5.0-W3.2-BL_SG5032
  rect 1.6x1.5 smd: 1(-1.27,-1.1) 2(1.27,-1.1) 3(1.27,1.1) 4(-1.27,1.1)
QFN-56_L7.0-W7.0-P0.40-TL-EP5.2
  rect 0.7x0.2 smd: 1(-3.45,2.6) 2(-3.45,2.2) 3(-3.45,1.8) 4(-3.45,1.4) 5(-3.45,1) 6(-3.45,0.6) 7(-3.45,0.2) 8(-3.45,-0.2) 9(-3.45,-0.6) 10(-3.45,-1) 11(-3.45,-1.4) 12(-3.45,-1.8) 13(-3.45,-2.2) 14(-3.45,-2.6) 29(3.45,-2.6) 30(3.45,-2.2) 31(3.45,-1.8) 32(3.45,-1.4) 33(3.45,-1) 34(3.45,-0.6) 35(3.45,-0.2) 36(3.45,0.2) 37(3.45,0.6) 38(3.45,1) 39(3.45,1.4) 40(3.45,1.8) 41(3.45,2.2) 42(3.45,2.6)
  rect 0.2x0.7 smd: 15(-2.6,-3.45) 16(-2.2,-3.45) 17(-1.8,-3.45) 18(-1.4,-3.45) 19(-1,-3.45) 20(-0.6,-3.45) 21(-0.2,-3.45) 22(0.2,-3.45) 23(0.6,-3.45) 24(1,-3.45) 25(1.4,-3.45) 26(1.8,-3.45) 27(2.2,-3.45) 28(2.6,-3.45) 43(2.6,3.45) 44(2.2,3.45) 45(1.8,3.45) 46(1.4,3.45) 47(1,3.45) 48(0.6,3.45) 49(0.2,3.45) 50(-0.2,3.45) 51(-0.6,3.45) 52(-1,3.45) 53(-1.4,3.45) 54(-1.8,3.45) 55(-2.2,3.45) 56(-2.6,3.45)
  rect 5.2x5.2 smd: 57(0,0)
R0402
  rect 0.566x0.54 smd: 1(-0.433,0) 2(0.433,0)
RF-SMD_FRF05002-JSS103M
  rect 1x1.05 smd: 1(0,-0.762)
  rect 1.05x2.2 smd: 2(-1.475,0.762) 3(1.475,0.762)
SOT-23-3_L2.9-W1.3-P1.90-LS2.4-BR
  rect 1x0.65 smd: 1(1,-0.95) 2(1,0.95) 3(-1,0)
SOT-25-5_L2.9-W1.6-P0.95-LS2.8-BL
  rect 0.623x1.105 smd: 1(-0.95,-1.3) 2(-0.001,-1.3) 3(0.95,-1.3) 4(0.95,1.3) 5(-0.95,1.3)
SW-SMD_L3.9-W3.0-LS5.0
  rect 1.05x2 smd: 1(-2.185,0) 2(2.185,0)
Test-Point-0.5mm
  round 1 smd: 1(0,0)
USB-C-SMD_KH-TYPE-C-16P
  oval 1x2 hole 0.6x1.7: 1(-4.32,1.765) 2(4.32,1.765)
  oval 1x1.8 hole 0.6x1.4: 3(-4.32,-2.415) 4(4.32,-2.415)
  rect 0.3x1.3 smd: A1(-3.35,2.415) A4(-2.55,2.415) A5(-1.25,2.415) A6(-0.25,2.415) A7(0.25,2.415) A8(1.25,2.415) A9(2.55,2.415) A12(3.35,2.415) B1(3.05,2.415) B4(2.25,2.415) B5(1.75,2.415) B6(0.75,2.415) B7(-0.75,2.415) B8(-1.75,2.415) B9(-2.25,2.415) B12(-3.05,2.415)

## Nets
As in the schematic, except:
GND: C1.2 C2.1 C3.1 C4.1 C7.2 C8.2 C9.2 C10.1 C11.2 C12.2 C13.1 C14.1 C15.1 C16.1 C17.1 C18.2 C30.1 J1.1 J1.2 J1.3 J1.4 J1.A1 J1.A12 J1.B1 J1.B12 J2.2 J2.3 J5.2 J5.21 J5.22 J6.1 J6.3 J6.21 J6.22 J7.1 LED1.2 LED2.1 Q1.2 R3.2 R50.1 R52.2 SW1.1 SW3.1 TPGND1.1 U1.57 U2.2 U3.3 U3.5 U3.11 Y1.1 Y1.2
RESET: R2.1 U3.6

Pads without a net: ANT1 2; J1 A8 B8; J7 5 6; U1 13 14; U2 4

## Via types
v1: diameter 0.61, hole 0.305, Top Layer to Bottom Layer, 36 vias

## Routing (per net, layer and track width the routed paths; a pad name or vN(x,y) marks a point on that pad's centre or on a via; arc(x,y) is an arc through that point)
+5V: length 41.6
  Top Layer w0.254: J1.B9 1.48,0.99 1.58,0.89 ; TP5.1 1.58,-3.84 J6.23 J6.24 ; TP5.1 1.53,-3.81 LED3.1 ; TP5.1 1.58,-3.76 1.58,0.89 ; 0.92,5.49 1.58,4.82 1.58,0.89 ; 0.92,5.49 1.78,6.35 v1(1.84,6.35) 1.84,7.96 LED4.1 ; 0.92,5.49 J1.B4
  Bottom Layer w0.254: C13.2 -6.94,8.4 -6.04,7.49 -5.24,7.49 U2.3 -5.21,6.6 -4.7,6.09 -3.75,6.09 -3.31,6.53 U2.1 -3.12,7.65 -3.12,8.38 -2.94,8.56 1.2,8.56 1.84,7.92 v1(1.84,6.35)
GND: length 83.3
  Top Layer w0.254: v1(-13.91,4.16) -15.77,4.16 R3.2 -17.71,3.61 TPGND1.1 ; v1(-24.33,5.33) LED1.2 -25.89,3.61 LED2.1 ; J1.1 -0.18,-0.76 J1.A1 ; C30.1 -7.55,4.74 SW1.1 -7.64,5.76 v1(-7.31,6.09) ; C9.2 v1(-49.6,0.38) ; J1.A12 -0.18,7.24 J1.2 ; J1.B1 -1.02,6.47 -3.17,6.47 R52.2 ; v1(-44.86,5.08) -44.86,4.82 -43.8,3.76 ; v1(-56.58,6.93) J2.3 J2.2 -52.66,3.98 C10.1 ; v1(-45.53,-1.4) -45.28,-1.4 C4.1 C16.1 ; R50.1 -2.85,0.19 J1.B12
  Bottom Layer w0.254: -44.31,1.22 -44.65,0.89 -44.65,-0.26 -43.65,-1.25 -43.65,-1.53 -41.86,-3.33 -41.19,-3.33 v1(-40.33,-4.19) -39.44,-4.19 -39.23,-3.98 ; -50.91,2.04 -50.77,1.9 v1(-49.34,1.9) ; C2.1 -6.8,-2.42 -6.12,-1.74 C12.2 -6.12,2.19 ; -6.12,2.19 v1(-5.82,1.9) -4.69,0.77 U3.5 ; -6.12,2.19 U3.11 U3.3 ; U2.2 -4.26,11.3 -4.08,11.48 -4.08,12.75 J5.21 ; J1.1 -1.79,-2.69 Q1.2 ; -32.62,3 -33.57,3.95 C1.2 -35.67,3.95 v1(-36.28,3.34) ; -43.29,6.64 v1(-44.86,5.08) -44.73,5.08 C3.1 C15.1 ; C13.1 -6.66,11.3 -4.26,11.3 ; C11.2 v1(-7.31,6.09)
VCC: length 52.3
  Top Layer w0.254: -41.22,3.43 -41.22,3.39 U1.15 ; J5.23 1.6,13.31 TP3.1 ; R40.2 v1(-10.99,1.7) ; U1.10 -39.71,4.79 -40.13,5.2 -42.11,5.2 ; U1.21 -38.87,1.02 -38.85,1.02 ; -38.85,1.02 -41.02,-1.15 -42.91,-1.15 C4.2 -43.84,-0.09 v1(-41.98,1.78) -41.85,1.65 -40.52,1.65 -40,2.17 U1.18 ; -38.85,1.02 -38.52,1.35 ; U1.44 -31.94,4.57 -31.18,4.57 v1(-30.93,4.32) ; R7.2 -9.34,8.51 ; -43.21,4.36 -42.36,5.2
  Bottom Layer w0.254: v1(-42.23,5.2) -42.44,4.99 C3.2 ; v1(-42.23,5.2) -42.23,4.19 C15.2 ; v1(-42.23,5.2) -42.23,5.59 -42.7,6.05 ; J5.23 1.25,13 1.25,11.1 1.07,10.92 -2.45,10.92 U2.5 ; v1(-10.99,1.7) -10.92,1.77 -9.44,1.77 -9.25,1.95 -8.5,1.95 -8.32,1.78 -8.32,1.01 -7.52,0.21 C12.1 ; C2.2 -13.85,-2.42 v1(-13.87,-2.44) ; R5.2 R4.2 -47.75,3.81 -47.75,3.22 -48.13,2.85 v1(-48.71,2.85) -49.16,2.85 -49.17,2.84 -50.91,2.84 ; C1.1 -32.54,4.5 -32.54,4.1 -32.03,3.6 -31.65,3.6 v1(-30.93,4.32)
  vias: v1(-41.23,3.34) v1(-9.21,8.51)
D+: length 18.9
  Top Layer w0.254: -3.12,4.06 -3.88,4.06 -4.69,4.88 R54.2 ; -3.12,4.06 -2.86,4.32 -2.1,4.32 -1.77,3.99 J1.B6 0.11,3.99 v1(0.57,4.44) ; -3.12,4.06 -3.12,3.43 -2.94,3.25 -2.94,3.25 -2.6,2.9 -1.86,2.9 -1.78,2.99 J1.A6
  Bottom Layer w0.254: U3.1 0.24,4.77 v1(0.57,4.44)
D-: length 17.6
  Top Layer w0.254: R53.2 -4.64,-3.76 -4.64,2.54 -4.39,2.79 -3.12,2.79 -2.81,2.49 J1.B7 -0.83,2.48 0.51,2.48 0.69,2.66 0.69,3.43 0.63,3.49 J1.A7 v1(-2.35,3.49)
  Bottom Layer w0.254: U3.2 -2.64,3.77 v1(-2.35,3.49)
DTR: length 4.7
  Bottom Layer w0.254: U3.4 -2.6,1.77 -2.23,1.39 -2.23,-0.56 R1.1
NRST(16): length 87.5
  Top Layer w0.254: U1.16 -40.7,2.03 -40.84,2.03 -41.47,2.66 -42.74,2.66 -46.68,-1.27 -49.85,-1.27 -51.76,-3.18 J6.2 ; SW1.2 -7.69,0.31 -7.69,1.61 C30.2 ; SW1.2 -7.64,-2.46 v1(-6.42,-3.69) ; SW1.2 -9.41,0.27 R40.1
  Bottom Layer w0.254: J6.2 -51.3,-7.44 -51.3,-8.08 -51.12,-8.26 -2.61,-8.26 -2.23,-7.88 -2.23,-5.72 -3.26,-4.69 Q1.3 -5.42,-4.69 v1(-6.42,-3.69)
PA0: length 12.1
  Top Layer w0.254: J6.4 -46.68,-6.61 -45.03,-4.96 -43.38,-4.96 -40.07,-1.65 -40.07,-0.73 U1.22
PA1: length 9.9
  Top Layer w0.254: U1.23 -38.3,0.44 -39.26,-0.52 -39.26,-2.11 J6.5
PA2: length 8.7
  Top Layer w0.254: -38.02,0.19 -38.02,0.16 -38.91,-0.73 -38.91,-4.3 J6.6
PA3: length 7.4
  Top Layer w0.254: J6.7 -38.55,-6.48 -38.55,-0.94 -37.73,-0.12 U1.25
PA4: length 13.9
  Top Layer w0.254: U1.30 -33.26,-2.8 -26.74,-2.8 -26.36,-3.18 J6.12
PA5: length 16.4
  Top Layer w0.254: J6.13 -24.27,-6.53 -24.27,-2.47 -24.45,-2.29 -33.2,-2.29 U1.31
PA6: length 18.3
  Top Layer w0.254: U1.32 -33.02,-1.91 -23.06,-1.91 -21.28,-3.69 J6.14
PA7: length 19.8
  Top Layer w0.254: -18.74,-6.99 -18.74,-5.21 -22.55,-1.4 -32.96,-1.4 -34.55,0.19
PA8: length 39.4
  Top Layer w0.254: v1(-31.18,6.09) -31.82,5.46 -32.18,5.46 -32.86,4.79
  Bottom Layer w0.254: v1(-31.18,6.09) -34.74,6.09 -37.41,3.43 -37.41,2.54 -36.26,1.39 -29.41,1.39 -28.29,2.51 -9.7,2.51 -9.44,2.77
PA9: length 21.9
  Top Layer w0.254: U1.47 -31.95,6.26 -31.95,8.89 -31.31,9.52 -20.01,9.52 J5.16
PA10: length 19.6
  Top Layer w0.254: U1.48 -32.33,6.45 -32.33,9.27 -31.63,9.97 -22.1,9.97 -18.74,13.33
PA11: length 17.4
  Top Layer w0.254: U1.49 -32.71,6.63 -32.71,9.65 -31.95,10.41 -24.2,10.41 J5.14
PA12: length 15
  Top Layer w0.254: J5.13 -26.23,10.92 -32.07,10.92 -33.09,9.9 -33.09,6.82 U1.50
PA15: length 24.4
  Top Layer w0.254: U1.5 -41.18,9.65 -45.03,9.65 -46.68,11.3 J5.4
  Bottom Layer w0.254: -50.91,4.44 -50.11,4.44 -49.6,4.95 R5.1 -48.63,10.36 -46.68,12.32 J5.4
PB0: length 26.7
  Top Layer w0.254: J6.18 -12.21,-5.9 -12.21,-4.5 -12.39,-4.32 -17.72,-4.32 -22.04,0 -32.66,0 U1.36
PB1: length 29.2
  Top Layer w0.254: J6.19 -9.92,-5.64 -9.92,-4.12 -10.1,-3.94 -17.34,-3.94 -21.66,0.38 -32.48,0.38 U1.37
PB2: length 30.7
  Top Layer w0.254: U1.38 -32.29,0.76 -21.28,0.76 -16.96,-3.56 -9.47,-3.56 J6.20
PB3: length 12.7
  Top Layer w0.254: U1.51 -33.47,7 -33.47,10.16 -32.33,11.3 -28.39,11.3 J5.12
PB4: length 10.9
  Top Layer w0.254: J5.11 -28.9,12.44 -29.53,11.81 -32.45,11.81 -33.85,10.41 -33.85,7.19 U1.52
PB5: length 6.8
  Top Layer w0.254: J5.8 -36.52,10.67 -34.99,9.14 -34.99,7.74 -35.4,7.33
PB6: length 9.6
  Top Layer w0.254: v1(-35.88,8.89) -35.68,8.69 -35.68,7.61 ; v1(-30.68,8.76) -30.22,8.76 -28.44,6.98
  Bottom Layer w0.254: v1(-30.68,8.76) -35.76,8.76 v1(-35.88,8.89)
PB7: length 44.4
  Top Layer w0.254: -36.89,7.61 -36.89,10.02 -39.06,12.19 J5.7
  Bottom Layer w0.254: J5.7 -39.06,13.84 -39.95,14.73 -56.58,14.73 -56.84,14.48 -56.84,10.79 -57.47,10.16 -57.47,5.33 -55.78,3.64 -48.8,3.64 R4.1
PB8: length 8
  Top Layer w0.254: U1.2 -37.53,7.7 -37.53,9.52 -41.34,13.33 J5.6
PB9: length 10.8
  Top Layer w0.254: J5.5 -44.14,12.44 -43.63,11.94 -40.71,11.94 -38.04,9.27 -38.04,7.64 U1.3
PB10: length 34
  Top Layer w0.254: U1.39 -32.11,1.14 -22.42,1.14 -17.34,6.22 -17.34,8.51 -16.45,9.4 -9.09,9.4 -6.04,12.44 J5.20
PB11: length 31.9
  Top Layer w0.254: -32.57,2.17 -31.92,1.52 -22.67,1.52 -17.85,6.35 -17.85,8.51 -16.58,9.78 -9.59,9.78 -8.58,10.79 J5.19
PB12: length 27.3
  Top Layer w0.254: U1.41 -31.74,1.9 -25.09,1.9 -16.83,10.16 -12.39,10.16 -11.12,11.43 J5.18
PB13: length 24
  Top Layer w0.254: J5.17 -13.66,11.81 -14.95,10.51 -16.98,10.51 -25.21,2.28 -31.55,2.28 U1.42
PB14: length 1.9
  Top Layer w0.254: R6.1 -31.37,3.3 -32.01,3.94
PB15: length 24.6
  Top Layer w0.254: v1(-30.8,5.2) -31.08,4.93 -32.12,4.93 -32.54,4.5 U1.45
  Bottom Layer w0.254: v1(-30.8,5.2) -28.52,5.2 -27.5,4.19 -17.72,4.19 -16.58,3.05 -12.26,3.05 -11.54,3.77 -9.44,3.77
PC0: length 7.6
  Top Layer w0.254: J6.8 -37.45,-6.05 -37.45,-2.47 -38.2,-1.73 -38.2,-1.15 -37.45,-0.4 U1.26
PC1: length 8.2
  Top Layer w0.254: U1.27 -37.66,-1.15 -37.66,-1.15 -37.84,-1.33 -37.84,-1.58 -33.98,-5.44 J6.9
PC2: length 7.6
  Top Layer w0.254: -36.95,-0.97 -31.95,-5.97 -31.95,-6.48
PC3: length 11.4
  Top Layer w0.254: J6.11 -28.85,-6.94 -28.85,-3.48 -29.02,-3.3 -33.32,-3.3 -35.68,-0.94
PC4: length 21.8
  Top Layer w0.254: J6.16 -16.2,-5.97 -16.96,-5.21 -18.1,-5.21 -22.42,-0.89 -32.9,-0.89 U1.34
PC5: length 24.4
  Top Layer w0.254: U1.35 -32.72,-0.51 -22.17,-0.51 -17.98,-4.7 -14.55,-4.7 -13.66,-5.59 J6.17
PC6: length 8.1
  Top Layer w0.254: -34.84,6.77 -34.23,7.37 -34.23,10.79 -31.69,13.33 J5.10
PC7: length 6.8
  Top Layer w0.254: U1.54 -34.61,7.55 -34.61,12.7 J5.9
PC8: length 47.3
  Top Layer w0.254: SW2.1 -13.9,1.9 -15.49,1.9 R3.1 ; SW2.1 -11.5,4.3 v1(-11.5,5.08) ; SW2.1 -11.43,-0.51 -11.37,-0.51 ; -37.73,6.77 -38.8,7.84 v1(-38.8,8.76)
  Bottom Layer w0.254: v1(-11.24,-0.51) R2.2 ; v1(-11.5,5.08) -11.5,10.16 -12.13,10.79 -36.77,10.79 v1(-38.8,8.76)
PC14: length 31.1
  Top Layer w0.254: v1(-16.2,8.38) -14.06,8.38 SW3.2 -11.45,8.53 R7.1 ; v1(-40.07,6.47) -39.7,6.47 U1.8
  Bottom Layer w0.254: v1(-40.07,6.47) -39.69,6.86 -17.72,6.86 v1(-16.2,8.38)
PC15: length 15.3
  Top Layer w0.254: v1(-41.34,6.47) -40.71,5.84 -39.64,5.84 U1.9 ; v1(-42.99,8.38) -47.31,8.38 -48.71,9.78 -48.71,12.82 J5.3
  Bottom Layer w0.254: v1(-42.99,8.38) -41.34,6.73 v1(-41.34,6.47)
RESET: length 1.3
  Bottom Layer w0.254: -9.44,0.77 -9.44,-0.48 R2.1
RF(12): length 15.2
  Top Layer w0.254: U1.12 -40.32,4.82 -41.22,4.82 -44.9,1.14 -52.39,1.14 -52.77,0.77 L1.1
SWCLK: length 17.5
  Top Layer w0.254: U1.7 -39.77,7.11 -51.38,7.11 -54.3,10.03 J20.1
SWDIO: length 16.2
  Top Layer w0.254: U1.6 -39.72,7.62 -51.12,7.62 -51.3,7.8 -51.3,9.7 -51.76,10.16
XTAL(19): length 6.7
  Top Layer w0.254: U1.19 -40.28,0.76 v1(-40.71,0.76)
  Bottom Layer w0.254: -40.3,-1.72 -38.63,-3.39 ; -40.3,-1.72 -40.3,0.35 v1(-40.71,0.76) ; -40.3,-1.72 Y1.4
XTAL(20): length 6.2
  Top Layer w0.254: v1(-42.1,0.02) -41.84,-0.23 -40.7,-0.23 U1.20
  Bottom Layer w0.254: -44.22,2.33 -42.61,0.71 -42.61,0.53
$1N59: length 1.4
  Bottom Layer w0.254: C11.1 -9.47,6.01 -9.47,4.79 -9.44,4.77
$1N91: length 12.3
  Top Layer w0.254: -54.32,1.78 -54.35,1.74 -54.35,0.18 -54.17,0 -52.9,0 -52.52,0.38 C9.1 ; -54.32,1.78 R01.1 ; -54.32,1.78 -53.42,1.78 L1.2 -53.19,1.99 C10.2 -50.65,1.99 -50.23,2.41 -50.23,3.88 R02.1
$1N92: length 1.9
  Top Layer w0.254: ANT1.1 -56.08,1.72 R01.2
$1N93: length 1.9
  Top Layer w0.254: J2.1 -50.94,5.46 R02.2
$1N149: length 2.1
  Bottom Layer w0.254: -4.96,-2.69 -4.96,-2.42 R1.2
$1N324: length 2.9
  Top Layer w0.254: -0.87,5.03 R52.1
$1N325: length 2.9
  Top Layer w0.254: J1.A5 -3.72,1.99
$1N10672: length 1.9
  Top Layer w0.254: R53.1 LED3.2
$1N10677: length 2
  Top Layer w0.254: R54.1 LED4.2
$1N12939: length 1.7
  Top Layer w0.254: R30.2 -27.59,6.97 LED1.1
$1N12956: length 1.9
  Top Layer w0.254: LED2.2 -29.36,3.42 R6.2

## Copper pours and planes (outline as drawn; the poured copper is in the pictures)
GND on GND: -59,15.24 6,15.24 6,-8.76 -59,-8.76
GND on GND: -59,15.24 6,15.24 6,-8.76 -59,-8.76
VCC on 3.3V: -59,15.24 6,15.24 6,-8.76 -59,-8.76
VCC on 3.3V: -59,15.24 6,15.24 6,-8.76 -59,-8.76
(no net) on Top Layer: -59,15.24 6,15.24 6,-8.76 -59,-8.76
(no net) on Bottom Layer: -59,15.24 6,15.24 6,-8.76 -59,-8.76
